# Altium schematic sheet Interface.SchDoc
size A3
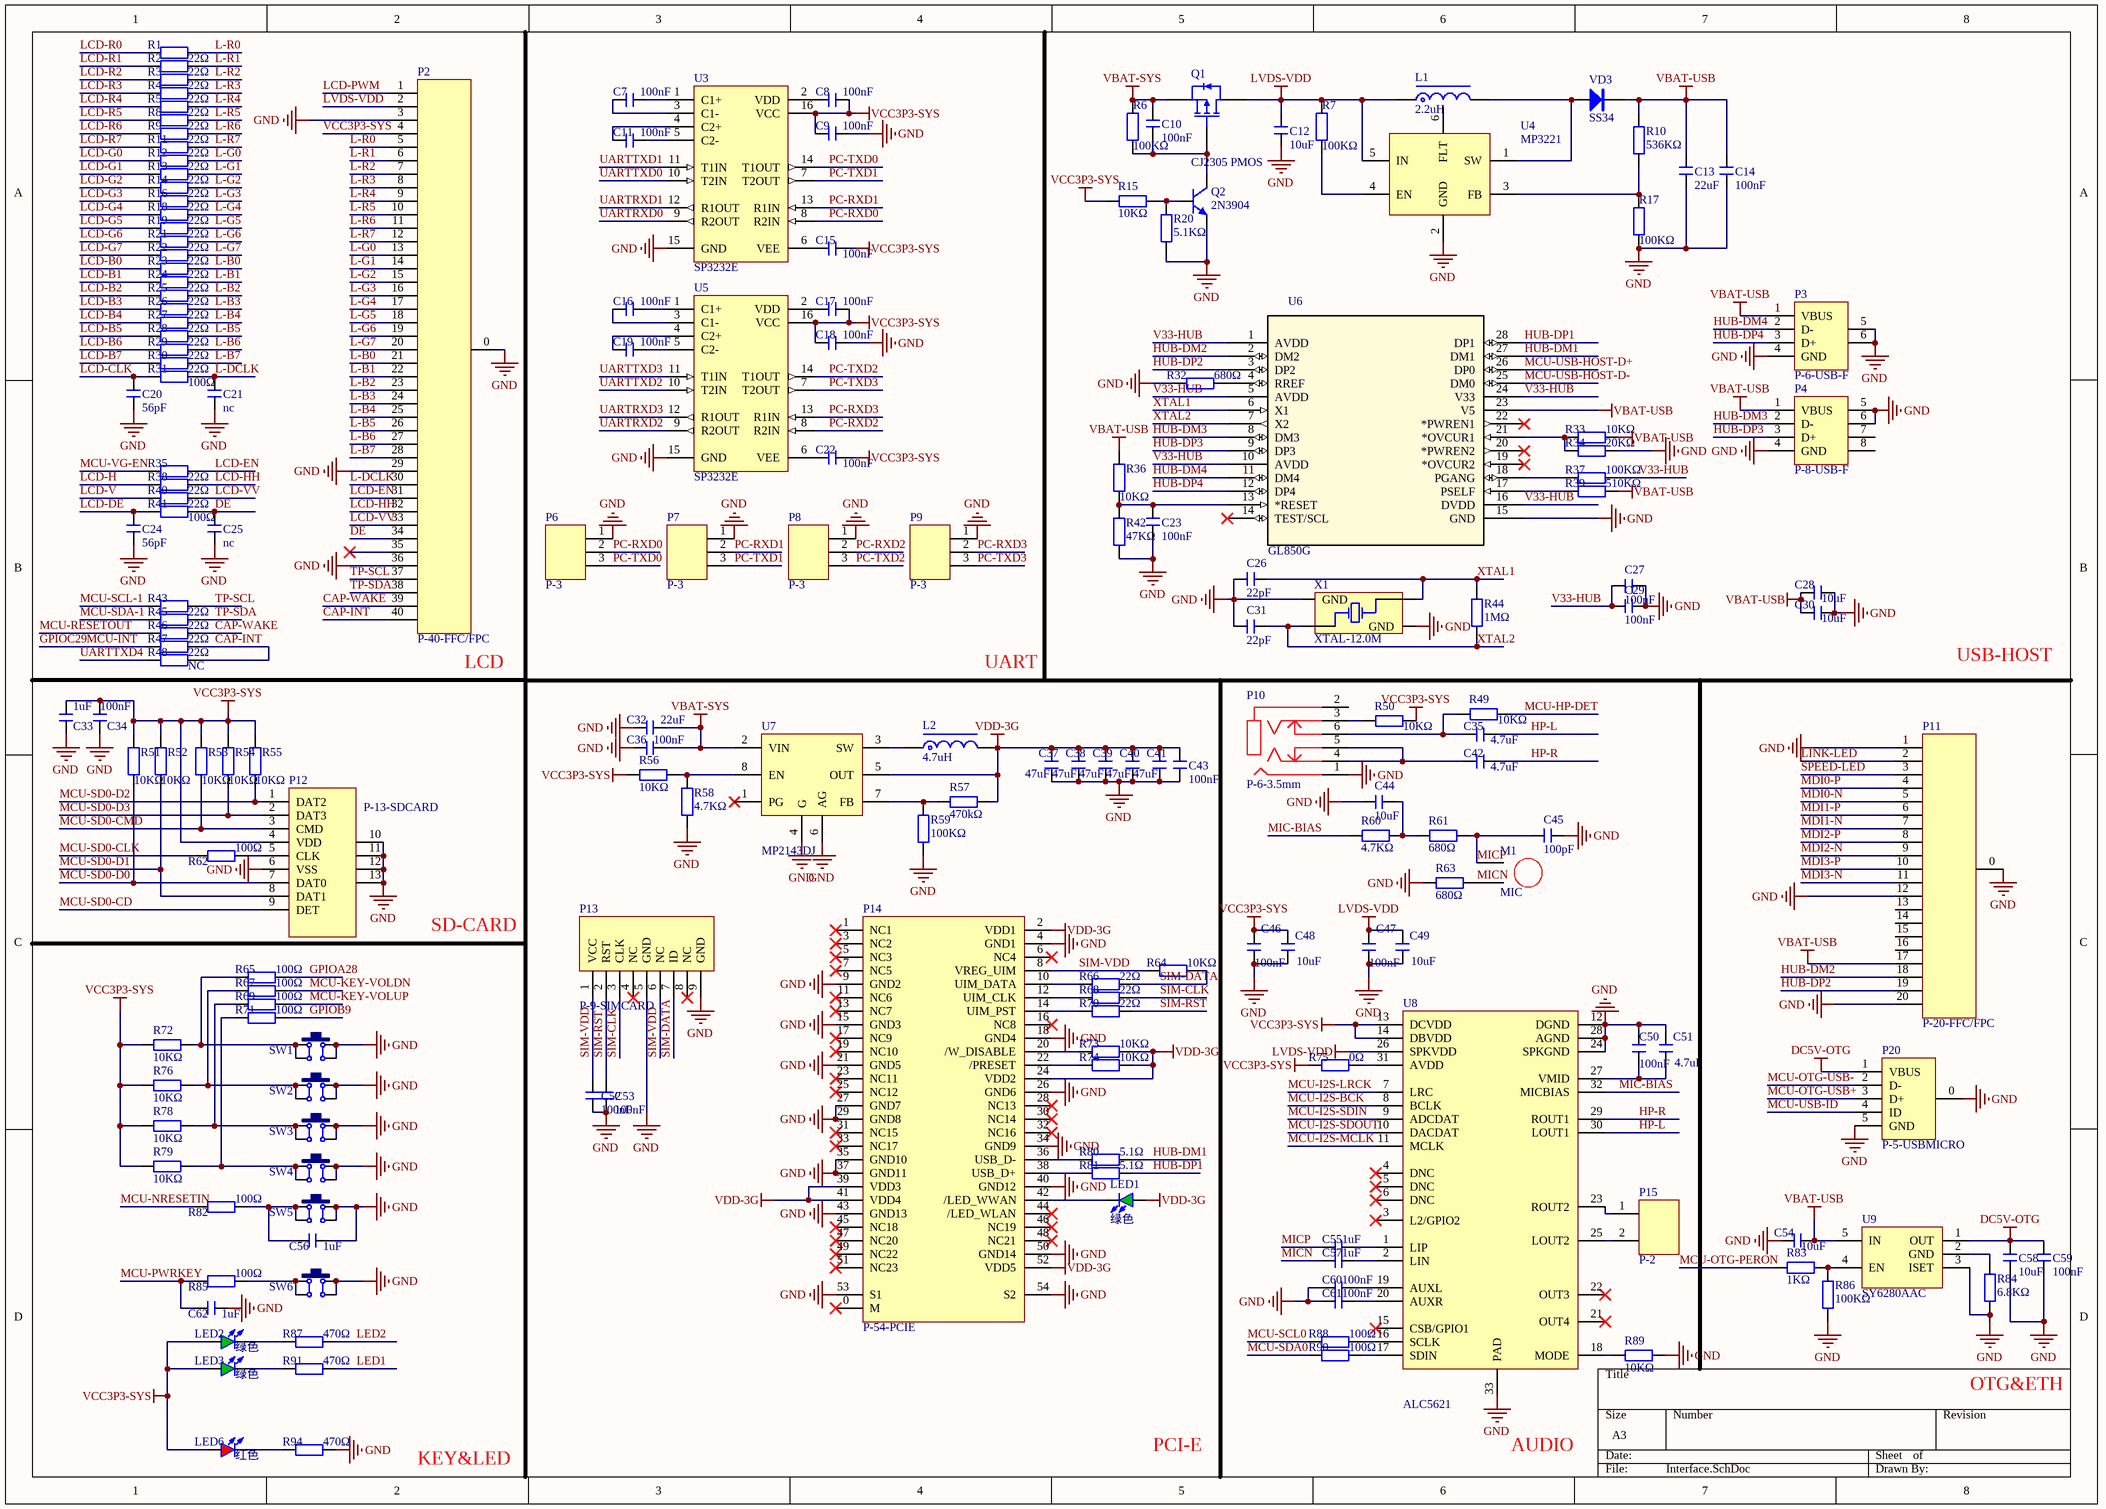
[diagram p0: Interface.SchDoc]

## Parts
C7  100nF  [C 0402]
C8  100nF  [C 0402]
C9  100nF  [C 0402]
C10  100nF  [C 0402]
C11  100nF  [C 0402]
C12  10uF  [C 0402]
C13  22uF  [C 0805]
C14  100nF  [C 0402]
C15  100nF  [C 0402]
C16  100nF  [C 0402]
C17  100nF  [C 0402]
C18  100nF  [C 0402]
C19  100nF  [C 0402]
C20  56pF  [C 0402]
C21  nc  [C 0402]
C22  100nF  [C 0402]
C23  100nF  [C 0402]
C24  56pF  [C 0402]
C25  nc  [C 0402]
C26  22pF  [C 0402]
C27  100nF  [C 0402]
C28  10uF  [C 0805]
C29  100nF  [C 0402]
C30  10uF  [C 0805]
C31  22pF  [C 0402]
C32  22uF  [C 0805]
C33  1uF  [C 0402]
C34  100nF  [C 0402]
C35  4.7uF  [C 0402]
C36  100nF  [C 0402]
C37  47uF  [C 1206]
C38  47uF  [C 1206]
C39  47uF  [C 1206]
C40  47uF  [C 1206]
C41  47uF  [C 1206]
C42  4.7uF  [C 0402]
C43  100nF  [C 0402]
C44  10uF  [C 0402]
C45  100pF  [C 0402]
C46  100nF  [C 0402]
C47  100nF  [C 0402]
C48  10uF  [C 0402]
C49  10uF  [C 0402]
C50  100nF  [C 0402]
C51  4.7uF  [C 0402]
C52  100nF  [C 0402]
C53  100nF  [C 0402]
C54  10uF  [C 0805]
C55  1uF  [C 0402]
C56  1uF  [C 0402]
C57  1uF  [C 0402]
C58  10uF  [C 0805]
C59  100nF  [C 0402]
C60  100nF  [C 0402]
C61  100nF  [C 0402]
C62  1uF  [C 0402]
L1  2.2uH  [L CD54]
L2  4.7uH  [L CD54]
LED1  绿色  [LED 0805G]
LED2  绿色  [LED 0603G]
LED3  绿色  [LED 0603G]
LED6  红色  [LED 0603R]
M1  MIC  [MIC]
P2  P-40-FFC/FPC  [P FFC/FPC-40]
P3  P-6-USB-F  [P USB-A]
P4  P-8-USB-F  [P USB2.0-4H4]
P6  P-3  [P XH2.54-3]
P7  P-3  [P XH2.54-3]
P8  P-3  [P XH2.54-3]
P9  P-3  [P XH2.54-3]
P10  P-6-3.5mm  [P 3.5mm音频座]
P11  P-20-FFC/FPC  [P FFC/FPC-20]
P12  P-13-SDCARD  [P TFCARD]
P13  P-9-SIMCARD  [P SIMCARD]
P14  P-54-PCIE  [P PCIE54-AB]
P15  P-2  [P XH2.54-2]
P20  P-5-USBMICRO  [P USB-MICRO2]
Q1  CJ2305 PMOS  [SC SOT23-3M]
Q2  2N3904  [SC SOT23-3M]
R1  22Ω  [R 0402]
R2  22Ω  [R 0402]
R3  22Ω  [R 0402]
R4  22Ω  [R 0402]
R5  22Ω  [R 0402]
R6  100KΩ  [R 0402]
R7  100KΩ  [R 0402]
R8  22Ω  [R 0402]
R9  22Ω  [R 0402]
R10  536KΩ  [R 0402-HP]
R11  22Ω  [R 0402]
R12  22Ω  [R 0402]
R13  22Ω  [R 0402]
R14  22Ω  [R 0402]
R15  10KΩ  [R 0402]
R16  22Ω  [R 0402]
R17  100KΩ  [R 0402-HP]
R18  22Ω  [R 0402]
R19  22Ω  [R 0402]
R20  5.1KΩ  [R 0402]
R21  22Ω  [R 0402]
R22  22Ω  [R 0402]
R23  22Ω  [R 0402]
R24  22Ω  [R 0402]
R25  22Ω  [R 0402]
R26  22Ω  [R 0402]
R27  22Ω  [R 0402]
R28  22Ω  [R 0402]
R29  22Ω  [R 0402]
R30  22Ω  [R 0402]
R31  100Ω  [R 0402]
R32  680Ω  [R 0402-HP]
R33  10KΩ  [R 0402]
R34  20KΩ  [R 0402]
R35  22Ω  [R 0402]
R36  10KΩ  [R 0402]
R37  100KΩ  [R 0402]
R38  22Ω  [R 0402]
R39  510KΩ  [R 0402]
R40  22Ω  [R 0402]
R41  100Ω  [R 0402]
R42  47KΩ  [R 0402]
R43  22Ω  [R 0402]
R44  1MΩ  [R 0402]
R45  22Ω  [R 0402]
R46  22Ω  [R 0402]
R47  22Ω  [R 0402]
R48  NC  [R 0402]
R49  10KΩ  [R 0402]
R50  10KΩ  [R 0402]
R51  10KΩ  [R 0402]
R52  10KΩ  [R 0402]
R53  10KΩ  [R 0402]
R54  10KΩ  [R 0402]
R55  10KΩ  [R 0402]
R56  10KΩ  [R 0402]
R57  470kΩ  [R 0402-HP]
R58  4.7KΩ  [R 0402]
R59  100KΩ  [R 0402-HP]
R60  4.7KΩ  [R 0402]
R61  680Ω  [R 0402]
R62  100Ω  [R 0402]
R63  680Ω  [R 0402]
R64  10KΩ  [R 0402]
R65  100Ω  [R 0402]
R66  22Ω  [R 0402]
R67  100Ω  [R 0402]
R68  22Ω  [R 0402]
R69  100Ω  [R 0402]
R70  22Ω  [R 0402]
R71  100Ω  [R 0402]
R72  10KΩ  [R 0402]
R73  10KΩ  [R 0402]
R74  10KΩ  [R 0402]
R75  0Ω  [R 0402]
R76  10KΩ  [R 0402]
R78  10KΩ  [R 0402]
R79  10KΩ  [R 0402]
R80  5.1Ω  [R 0402]
R81  5.1Ω  [R 0402]
R82  100Ω  [R 0402]
R83  1KΩ  [R 0402]
R84  6.8KΩ  [R 0402]
R85  100Ω  [R 0402]
R86  100KΩ  [R 0402]
R87  470Ω  [R 0402]
R88  100Ω  [R 0402]
R89  10KΩ  [R 0402]
R90  100Ω  [R 0402]
R91  470Ω  [R 0402]
R94  470Ω  [R 0402]
SW1  6x6x5  [KS TSW-SMD-6*6*4.3]  (value not drawn)
SW2  6x6x5  [KS TSW-SMD-6*6*4.3]  (value not drawn)
SW3  6x6x5  [KS TSW-SMD-6*6*4.3]  (value not drawn)
SW4  6x6x5  [KS TSW-SMD-6*6*4.3]  (value not drawn)
SW5  6x6x5  [KS TSW-SMD-6*6*4.3]  (value not drawn)
SW6  6x6x5  [KS TSW-SMD-6*6*4.3]  (value not drawn)
U3  SP3232E  [TSSOP16]
U4  MP3221  [SOT23-6L]
U5  SP3232E  [TSSOP16]
U6  GL850G  [SSOP28_N]
U7  MP2143DJ  [TSOT23-8]
U8  ALC5621  [QFN32_L]
U9  SY6280AAC  [SOT23-5M]
VD3  SS34  [D SMC]
X1  XTAL-12.0M  [XTAL-3225]

## Nets
DC5V-OTG: C58.1 C59.2 P20.1(VBUS) U9.1(OUT)
GND: C9.2 C12.1 C13.1 C14.1 C18.2 C20.1 C21.1 C23.1 C24.1 C25.1 C26.1 C27.2 C28.1 C29.2 C30.1 C31.1 C32.1 C33.1 C34.1 C36.1 C37.1 C38.1 C39.1 C40.1 C41.1 C43.1 C44.1 C45.2 C46.1 C47.1 C48.1 C49.1 C50.2 C51.1 C52.1 C53.1 C54.2 C56.2 C58.2 C59.1 C60.2 C61.2 C62.2 P2.0 P2.3 P2.29 P2.36 P3.4(GND) P3.5 P3.6 P4.4(GND) P4.5 P4.6 P6.1 P7.1 P8.1 P9.1 P10.1 P11.0 P11.1 P11.12 P11.20 P12.6(VSS) P12.10 P12.11 P12.12 P12.13 P13.5(GND) P13.9(GND) P14.4(GND1) P14.9(GND2) P14.15(GND3) P14.18(GND4) P14.21(GND5) P14.26(GND6) P14.27(GND7) P14.29(GND8) P14.35(GND10) P14.37(GND11) P14.40(GND12) P14.43(GND13) P14.50(GND14) P14.53(S1) P14.54(S2) P20.0 P20.5(GND) Q2.1(E) R17.1 R20.1 R32.1 R34.2 R42.1 R58.1 R59.1 R63.1 R84.1 R86.1 R89.2 R94.2 SW1.2 SW1.3 SW2.2 SW2.3 SW3.2 SW3.3 SW4.2 SW4.3 SW5.2 SW5.3 SW6.2 SW6.3 U3.15(GND) U4.2(GND) U5.15(GND) U6.15(GND) U7.4(G) U7.6(AG) U8.12(DGND) U8.24(SPKGND) U8.28(AGND) U8.33(PAD) U9.3(ISET) X1.2(GND) X1.4(GND)
LVDS-VDD: C12.2 C47.2 C49.2 L1.1 P2.2 Q1.3(D) R7.2 U4.5(IN) U8.26(SPKVDD)
VBAT-SYS: C10.2 C32.2 C36.2 Q1.2(S) R6.2 U7.2(VIN)
VBAT-USB: C13.2 C14.2 C28.2 C30.2 C54.1 P3.1(VBUS) P4.1(VBUS) P11.17 R10.2 R33.2 R36.2 R39.2 U6.23(V5) U9.5(IN) VD3.K
VCC3P3-SYS: C8.2 C9.1 C15.2 C17.2 C18.1 C22.2 C33.2 C34.2 C46.2 C48.2 LED2.A LED3.A LED6.A P2.4 P12.4(VDD) R15.1 R50.2 R51.2 R52.2 R53.2 R54.2 R55.2 R56.1 R72.1 R75.1 R76.1 R78.1 R79.1 U3.16(VCC) U5.16(VCC) U8.13(DCVDD) U8.14(DBVDD)
VDD-3G: C37.2 C38.2 C39.2 C40.2 C41.2 C43.2 L2.2 LED1.A P14.2(VDD1) P14.24(VDD2) P14.39(VDD3) P14.41(VDD4) P14.52(VDD5) R57.2 R73.2 R74.2 U7.5(OUT)
CAP-INT: P2.40 R47.2 R48.2
CAP-WAKE: P2.39 R46.2
DE: C25.2 P2.34 R41.2
GPIOA28: R65.2
GPIOB9: R71.2
GPIOC29: R47.1  [also labelled MCU-INT]
HP-L: C35.2 U8.30(LOUT1)
HP-R: C42.2 U8.29(ROUT1)
HUB-DM1: R80.2 U6.27(DM1)
HUB-DM2: P11.18 U6.2(DM2)
HUB-DM3: P4.2(D-) U6.8(DM3)
HUB-DM4: P3.2(D-) U6.11(DM4)
HUB-DP1: R81.2 U6.28(DP1)
HUB-DP2: P11.19 U6.3(DP2)
HUB-DP3: P4.3(D+) U6.9(DP3)
HUB-DP4: P3.3(D+) U6.12(DP4)
L-B0: P2.21 R23.2
L-B1: P2.22 R24.2
L-B2: P2.23 R25.2
L-B3: P2.24 R26.2
L-B4: P2.25 R27.2
L-B5: P2.26 R28.2
L-B6: P2.27 R29.2
L-B7: P2.28 R30.2
L-DCLK: C21.2 P2.30 R31.2
L-G0: P2.13 R12.2
L-G1: P2.14 R13.2
L-G2: P2.15 R14.2
L-G3: P2.16 R16.2
L-G4: P2.17 R18.2
L-G5: P2.18 R19.2
L-G6: P2.19 R21.2
L-G7: P2.20 R22.2
L-R0: P2.5 R1.2
L-R1: P2.6 R2.2
L-R2: P2.7 R3.2
L-R3: P2.8 R4.2
L-R4: P2.9 R5.2
L-R5: P2.10 R8.2
L-R6: P2.11 R9.2
L-R7: P2.12 R11.2
LCD-B0: R23.1
LCD-B1: R24.1
LCD-B2: R25.1
LCD-B3: R26.1
LCD-B4: R27.1
LCD-B5: R28.1
LCD-B6: R29.1
LCD-B7: R30.1
LCD-CLK: C20.2 R31.1
LCD-DE: C24.2 R41.1
LCD-EN: P2.31 R35.2
LCD-G0: R12.1
LCD-G1: R13.1
LCD-G2: R14.1
LCD-G3: R16.1
LCD-G4: R18.1
LCD-G5: R19.1
LCD-G6: R21.1
LCD-G7: R22.1
LCD-H: R38.1
LCD-HH: P2.32 R38.2
LCD-PWM: P2.1
LCD-R0: R1.1
LCD-R1: R2.1
LCD-R2: R3.1
LCD-R3: R4.1
LCD-R4: R5.1
LCD-R5: R8.1
LCD-R6: R9.1
LCD-R7: R11.1
LCD-V: R40.1
LCD-VV: P2.33 R40.2
LED1: R91.2
LED2: R87.2
LINK-LED: P11.2
MCU-HP-DET: R49.2
MCU-I2S-BCK: U8.8(BCLK)
MCU-I2S-LRCK: U8.7(LRC)
MCU-I2S-MCLK: U8.11(MCLK)
MCU-I2S-SDIN: U8.9(ADCDAT)
MCU-I2S-SDOUT: U8.10(DACDAT)
MCU-KEY-VOLDN: R67.2
MCU-KEY-VOLUP: R69.2
MCU-NRESETIN: R82.1
MCU-OTG-PERON: R83.1
MCU-OTG-USB+: P20.3(D+)
MCU-OTG-USB-: P20.2(D-)
MCU-PWRKEY: C62.1 R85.1
MCU-RESETOUT: R46.1
MCU-SCL0: R88.1
MCU-SCL-1: R43.1
MCU-SD0-CD: P12.9(DET)
MCU-SD0-CLK: R62.1
MCU-SD0-CMD: P12.3(CMD) R53.1
MCU-SD0-D0: P12.7(DAT0) R51.1
MCU-SD0-D1: P12.8(DAT1) R52.1
MCU-SD0-D2: P12.1(DAT2) R55.1
MCU-SD0-D3: P12.2(DAT3) R54.1
MCU-SDA0: R90.1
MCU-SDA-1: R45.1
MCU-USB-HOST-D+: U6.26(DP0)
MCU-USB-HOST-D-: U6.25(DM0)
MCU-USB-ID: P20.4(ID)
MCU-VG-EN: R35.1
MDI0-N: P11.5
MDI0-P: P11.4
MDI1-N: P11.7
MDI1-P: P11.6
MDI2-N: P11.9
MDI2-P: P11.8
MDI3-N: P11.11
MDI3-P: P11.10
MIC-BIAS: R60.1 U8.32(MICBIAS)
MICN: C57.1 M1.2 R63.2
MICP: C45.1 C55.1 M1.1 R61.2
PC-RXD0: P6.2 U3.8(R2IN)
PC-RXD1: P7.2 U3.13(R1IN)
PC-RXD2: P8.2 U5.8(R2IN)
PC-RXD3: P9.2 U5.13(R1IN)
PC-TXD0: P6.3 U3.14(T1OUT)
PC-TXD1: P7.3 U3.7(T2OUT)
PC-TXD2: P8.3 U5.14(T1OUT)
PC-TXD3: P9.3 U5.7(T2OUT)
SIM-CLK: P13.3(CLK) R68.2
SIM-DATA: P13.7(ID) R64.2 R66.2
SIM-RST: C53.2 P13.2(RST) R70.2
SIM-VDD: C52.2 P13.1(VCC) P13.6(NC) P14.8(VREG_UIM) R64.1
SPEED-LED: P11.3
TP-SCL: P2.37 R43.2
TP-SDA: P2.38 R45.2
UARTRXD0: U3.9(R2OUT)
UARTRXD1: U3.12(R1OUT)
UARTRXD2: U5.9(R2OUT)
UARTRXD3: U5.12(R1OUT)
UARTTXD0: U3.10(T2IN)
UARTTXD1: U3.11(T1IN)
UARTTXD2: U5.10(T2IN)
UARTTXD3: U5.11(T1IN)
UARTTXD4: R48.1
V33-HUB: C27.1 C29.1 R37.1 U6.1(AVDD) U6.5(AVDD) U6.10(AVDD) U6.16(DVDD) U6.24(V33)
XTAL1: C26.2 R44.2 U6.6(X1) X1.3(OSC2)
XTAL2: C31.2 R44.1 U6.7(X2) X1.1(OSC1)
NetC7_1: C7.1 U3.3(C1-)
NetC7_2: C7.2 U3.1(C1+)
NetC8_1: C8.1 U3.2(VDD)
NetC10_1: C10.1 Q1.1(G) Q2.3(C) R6.1
NetC11_1: C11.1 U3.4(C2+)
NetC11_2: C11.2 U3.5(C2-)
NetC15_1: C15.1 U3.6(VEE)
NetC16_1: C16.1 U5.3(C1-)
NetC16_2: C16.2 U5.1(C1+)
NetC17_1: C17.1 U5.2(VDD)
NetC19_1: C19.1 U5.4(C2+)
NetC19_2: C19.2 U5.5(C2-)
NetC22_1: C22.1 U5.6(VEE)
NetC23_2: C23.2 R36.1 R42.2 U6.13(*RESET)
NetC35_1: C35.1 P10.6 R49.1
NetC42_1: C42.1 P10.4 P10.5
NetC44_2: C44.2 R60.2 R61.1
NetC50_1: C50.1 C51.2 U8.27(VMID)
NetC55_2: C55.2 U8.1(LIP)
NetC56_1: C56.1 R82.2 SW5.1 SW5.4
NetC57_2: C57.2 U8.2(LIN)
NetC60_1: C60.1 U8.19(AUXL)
NetC61_1: C61.1 U8.20(AUXR)
NetL1_2: L1.2 U4.1(SW) VD3.A
NetL2_1: L2.1 U7.3(SW)
NetLED1_K: LED1.K P14.42(/LED_WWAN)
NetLED2_K: LED2.K R87.1
NetLED3_K: LED3.K R91.1
NetLED6_K: LED6.K R94.1
NetP10_3: P10.3 R50.1
NetP12_5: P12.5(CLK) R62.2
NetP14_10: P14.10(UIM_DATA) R66.1
NetP14_12: P14.12(UIM_CLK) R68.1
NetP14_14: P14.14(UIM_PST) R70.1
NetP14_20: P14.20(/W_DISABLE) R73.1
NetP14_22: P14.22(/PRESET) R74.1
NetP14_36: P14.36(USB_D-) R80.1
NetP14_38: P14.38(USB_D+) R81.1
NetP15_1: P15.1 U8.23(ROUT2)
NetP15_2: P15.2 U8.25(LOUT2)
NetQ2_2: Q2.2(B) R15.2 R20.2
NetR7_1: R7.1 U4.4(EN)
NetR10_1: R10.1 R17.2 U4.3(FB)
NetR32_2: R32.2 U6.4(RREF)
NetR33_1: R33.1 R34.1 U6.21(*OVCUR1)
NetR37_2: R37.2 U6.18(PGANG)
NetR39_1: R39.1 U6.17(PSELF)
NetR56_2: R56.2 R58.2 U7.8(EN)
NetR57_1: R57.1 R59.2 U7.7(FB)
NetR65_1: R65.1 R72.2 SW1.1 SW1.4
NetR67_1: R67.1 R76.2 SW2.1 SW2.4
NetR69_1: R69.1 R78.2 SW3.1 SW3.4
NetR71_1: R71.1 R79.2 SW4.1 SW4.4
NetR75_2: R75.2 U8.31(AVDD)
NetR83_2: R83.2 R86.2 U9.4(EN)
NetR84_2: R84.2 U9.2(GND)
NetR85_2: R85.2 SW6.1 SW6.4
NetR88_2: R88.2 U8.16(SCLK)
NetR89_1: R89.1 U8.18(MODE)
NetR90_2: R90.2 U8.17(SDIN)

Not connected (* = marked no-connect by the designer): P2 35*; P4 7 8; P10 2; P11 13 14 15 16; P13 4(NC)* 8(NC)*; P14 0(M)* 1(NC1)* 3(NC2)* 5(NC3)* 6(NC4)* 7(NC5)* 11(NC6)* 13(NC7)* 16(NC8)* 17(NC9)* 19(NC10)* 23(NC11)* 25(NC12)* 28(NC13)* 30(NC14)* 31(NC15)* 32(NC16)* 33(NC17)* 34(GND9) 44(/LED_WLAN)* 45(NC18)* 46(NC19)* 47(NC20)* 48(NC21)* 49(NC22)* 51(NC23)*; U4 6(FLT); U6 14(TEST/SCL)* 19(*OVCUR2)* 20(*PWREN2)* 22(*PWREN1)*; U7 1(PG)*; U8 3(L2/GPIO2)* 4(DNC)* 5(DNC)* 6(DNC)* 15(CSB/GPIO1)* 21(OUT4)* 22(OUT3)*

## Notes on the sheet
- (near P2) LCD
- UART
- USB-HOST
- SD-CARD
- OTG&ETH
- PCI-E
- AUDIO
- KEY&LED
- Labels drawn without touching a wire or pin: GND

## Library data of the parts
C7-C11 C14-C19 C22 C23 C27 C29 C34 C36 C43 C46 C47 C50 C52 C53 C59-C61 = C 100nF: 无极性贴片电容; 版权归属: 源创客; BOM名称: 无极性贴片电容; 学习资源: www.ooocke.com
C12 C28 C30 C44 C48 C49 C54 C58 = C 10uF: 无极性贴片电容; 版权归属: 源创客; BOM名称: 无极性贴片电容; 学习资源: www.ooocke.com
C13 C32 C37-C41 = C 22uF: 无极性贴片电容; 版权归属: 源创客; BOM名称: 无极性贴片电容; 学习资源: www.ooocke.com
C20 C21 C24 C25 = C 56pF: 无极性贴片电容; 版权归属: 源创客; BOM名称: 无极性贴片电容; 学习资源: www.ooocke.com
C26 C31 = C 22pF: 无极性贴片电容; 版权归属: 源创客; BOM名称: 无极性贴片电容; 学习资源: www.ooocke.com
C33 C55-C57 C62 = C 1uF: 无极性贴片电容; 版权归属: 源创客; BOM名称: 无极性贴片电容; 学习资源: www.ooocke.com
C35 C42 C51 = C 4.7uF: 无极性贴片电容; 版权归属: 源创客; BOM名称: 无极性贴片电容; 学习资源: www.ooocke.com
C45 = C 100pF: 无极性贴片电容; 版权归属: 源创客; BOM名称: 无极性贴片电容; 学习资源: www.ooocke.com
L1 L2 = L-CD  3.3uH: 贴片功率电感; BOM名称: 功率电感; 版权归属: 源创客; 学习资源: www.ooocke.com
LED1-LED3 = LED SMD-GREEN: 贴片LED; 版权归属: 源创客; BOM名称: 贴片LED; 学习资源: www.ooocke.com
LED6 = LED SMD-RED: 贴片LED; 版权归属: 源创客; BOM名称: 贴片LED; 学习资源: www.ooocke.com
M1 = MIC: 耳麦
P2 = P-40-FFC/PFC: 40脚FFC/PFC接口
P3 = P-6-USB-F: 卧式USB母头
P4 = P-8-USB-F: 立式USB母头
P6-P9 = P-3: 3脚接插件
P10 = P-6-3.5mm: 耳机座
P11 = P-20-FFC/PFC: 20脚FFC/PFC接口
P12 = P-13-SDCARD: SD卡
P13 = P-9-SIMCARD: SIM卡插槽
P14 = P-54-PCIE: PCIE接口
P15 = P-2: 2脚接插件
P20 = P-5-USBMICRO: USBMICRO
Q1 = CJ2305 PMOS: MOS管
Q2 = S9013: 低频放大-NPN型; BOM名称: 低频放大-PNP型; 版权归属: 源创客; 属性: 50V 0.5A 0.625W; 学习资源: www.ooocke.com
R1-R5 R8 R9 R11-R14 R16 R18 R19 R21-R30 R35 R38 R40 R43 R45-R48 R66 R68 R70 = R 22Ω: 贴片电阻; 版权归属: 源创客; BOM名称: 贴片电阻; 学习资源: www.ooocke.com
R6 R7 R17 R37 R59 R86 = R 100KΩ: 贴片电阻; 版权归属: 源创客; BOM名称: 贴片电阻; 学习资源: www.ooocke.com
R10 = R 536KΩ: 贴片电阻; 版权归属: 源创客; BOM名称: 贴片电阻; 学习资源: www.ooocke.com
R15 R33 R36 R49-R56 R64 R72-R74 R76 R78 R79 R89 = R 10KΩ: 贴片电阻; 版权归属: 源创客; BOM名称: 贴片电阻; 学习资源: www.ooocke.com
R20 = R 5.1KΩ: 贴片电阻; 版权归属: 源创客; BOM名称: 贴片电阻; 学习资源: www.ooocke.com
R31 R41 R62 R65 R67 R69 R71 R82 R85 R88 R90 = R 100Ω: 贴片电阻; 版权归属: 源创客; BOM名称: 贴片电阻; 学习资源: www.ooocke.com
R32 R61 R63 = R 680Ω: 贴片电阻; 版权归属: 源创客; BOM名称: 贴片电阻; 学习资源: www.ooocke.com
R34 = R 20KΩ: 贴片电阻; 版权归属: 源创客; BOM名称: 贴片电阻; 学习资源: www.ooocke.com
R39 = R 510KΩ: 贴片电阻; 版权归属: 源创客; BOM名称: 贴片电阻; 学习资源: www.ooocke.com
R42 = R 47KΩ: 贴片电阻; 版权归属: 源创客; BOM名称: 贴片电阻; 学习资源: www.ooocke.com
R44 = R 1MΩ: 贴片电阻; 版权归属: 源创客; BOM名称: 贴片电阻; 学习资源: www.ooocke.com
R57 R87 R91 R94 = R 470Ω: 贴片电阻; 版权归属: 源创客; BOM名称: 贴片电阻; 学习资源: www.ooocke.com
R58 R60 = R 4.7KΩ: 贴片电阻; 版权归属: 源创客; BOM名称: 贴片电阻; 学习资源: www.ooocke.com
R75 = R 0Ω: 贴片电阻; 版权归属: 源创客; BOM名称: 贴片电阻; 学习资源: www.ooocke.com
R80 R81 = R 5.1Ω: 贴片电阻; 版权归属: 源创客; BOM名称: 贴片电阻; 学习资源: www.ooocke.com
R83 = R 1KΩ: 贴片电阻; 版权归属: 源创客; BOM名称: 贴片电阻; 学习资源: www.ooocke.com
R84 = R 6.8KΩ: 贴片电阻; 版权归属: 源创客; BOM名称: 贴片电阻; 学习资源: www.ooocke.com
SW1-SW6 = KS  TSW SMD-6x6: 贴片6x6轻触开关; 版权归属: 源创客; BOM名称: 贴片6x6轻触开关; 学习资源: www.ooocke.com
U3 U5 = SP3232E: RS232; ComponentLink1Description: 供应商链接; ComponentLink1URL: http://www.szlcsc.com/product/details_27608.html; Package: SOIC-16_150mil; Supplier: LC; 商品编号: G0086
U4 = MP3221: DC-DC芯片
U6 = GL850G: USB芯片; Manufacturer_Part_Number: GL850G-HHG22-M9; Vendor: Genesys Logic Inc; Built_By: EMA_Jessica; Copyright: Copyright (C) 2016 Accelerated Designs. All rights reserved; RefDes: RefDes; Type: DEV; Value: Value
U7 = MP2143DJ: DC-DC芯片
U8 = ALC5621: 音频处理芯片
U9 = SY6280AAC: 功率开关芯片
VD3 = SS34: 肖特基二极管; 版权归属: 源创客; 属性: 40V/3A; BOM名称: 肖特基二极管; 学习资源: www.ooocke.com
X1 = XTAL-12.0M: 12M晶振